# Altium schematic sheet ST_Link.SchDoc
size B
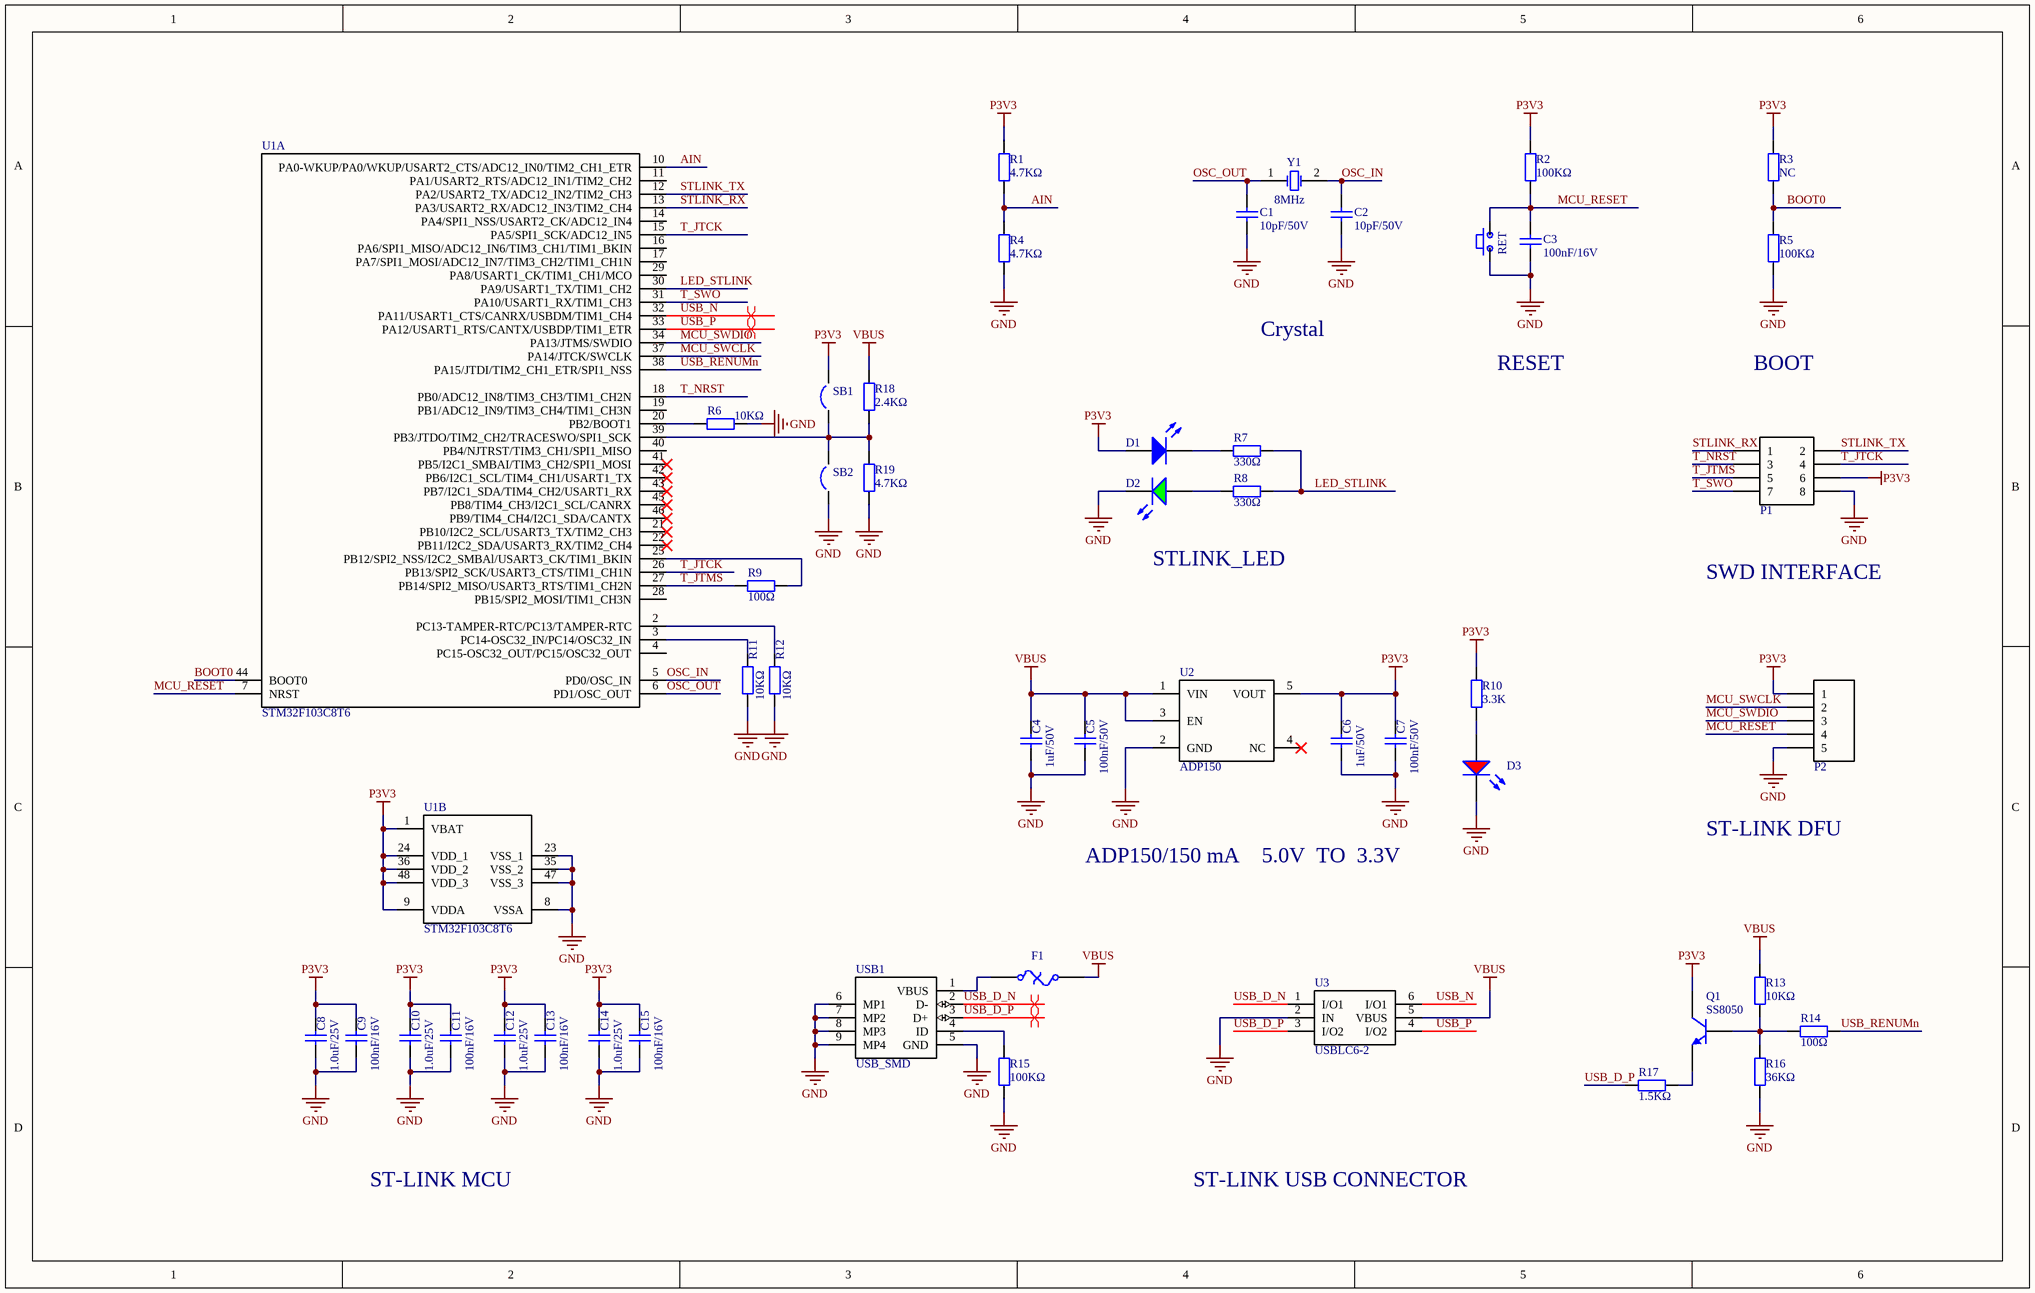
[diagram p0: ST_Link.SchDoc]

## Parts
C1  10pF/50V  [0402_C]
C2  10pF/50V  [0402_C]
C3  100nF/16V  [0402_C]
C4  1uF/50V  [0603_C]
C5  100nF/50V  [0603_C]
C6  1uF/50V  [0603_C]
C7  100nF/50V  [0603_C]
C8  1.0uF/25V  [0402_C]
C9  100nF/16V  [0402_C]
C10  1.0uF/25V  [0402_C]
C11  100nF/16V  [0402_C]
C12  1.0uF/25V  [0402_C]
C13  100nF/16V  [0402_C]
C14  1.0uF/25V  [0402_C]
C15  100nF/16V  [0402_C]
D1  (no value)  [0603_LED_S1]
D2  (no value)  [0603_LED_S1]
D3  红灯 0603  [0603_LED_S1]  (value not drawn)
F1  500mA  [F1206]  (value not drawn)
P1  Header  [SMT 2*4 2.54]  (value not drawn)
P2  Header 5  [DIP5_2.00]  (value not drawn)
Q1  SS8050  [SOT-23(SOT-23-3)]
R1  4.7KΩ  [0402_R]
R2  100KΩ  [0402_R]
R3  NC  [0402_R]
R4  4.7KΩ  [0402_R]
R5  100KΩ  [0402_R]
R6  10KΩ  [0402_R]
R7  330Ω  [0402_R]
R8  330Ω  [0402_R]
R9  100Ω  [0402_R]
R10  3.3K  [0603_R]
R11  10KΩ  [0402_R]
R12  10KΩ  [0402_R]
R13  10KΩ  [0402_R]
R14  100Ω  [0402_R]
R15  100KΩ  [0402_R]
R16  36KΩ  [0402_R]
R17  1.5KΩ  [0402_R]
R18  2.4KΩ  [0402_R]
R19  4.7KΩ  [0402_R]
RET  Button  [SKRKAHE020]  (value not drawn)
SB1  SB  [SB]  (value not drawn)
SB2  SB  [SB]  (value not drawn)
U1  STM32F103C8T6  [LQFP-48]  (parts A,B of 2)
U2  ADP150  [SOT23-5]
U3  USBLC6-2  [SOT23-6]
USB1  USB_SMD  [USB_Micro]
Y1  8MHz  [SMD-5032_2P]

## Nets
GND: C1.1 C2.1 C3.1 C4.1 C5.1 C6.1 C7.1 C8.1 C9.1 C10.1 C11.1 C12.1 C13.1 C14.1 C15.1 D2.K D3.K P1.8 P2.5 R4.1 R5.1 R6.1 R11.1 R12.1 R15.1 R16.1 R19.1 RET.1 SB2.2 U1.8(VSSA) U1.23(VSS_1) U1.35(VSS_2) U1.47(VSS_3) U2.2(GND) U3.2(IN) USB1.5(GND) USB1.6(MP1) USB1.7(MP2) USB1.8(MP3) USB1.9(MP4)
P3V3: C6.2 C7.2 C8.2 C9.2 C10.2 C11.2 C12.2 C13.2 C14.2 C15.2 D1.A P1.6 P2.1 Q1.3(C) R1.2 R2.2 R3.2 R10.2 SB1.2 U1.1(VBAT) U1.9(VDDA) U1.24(VDD_1) U1.36(VDD_2) U1.48(VDD_3) U2.5(VOUT)
VBUS: C4.2 C5.2 F1.2 R13.2 R18.2 U2.1(VIN) U2.3(EN) U3.5(VBUS)
AIN: R1.1 R4.2 U1.10(PA0-WKUP/PA0/WKUP/USART2_CTS/ADC12_IN0/TIM2_CH1_ETR)
BOOT0: R3.1 R5.2 U1.44(BOOT0)
LED_STLINK: R7.2 R8.2 U1.30(PA9/USART1_TX/TIM1_CH2)
MCU_RESET: C3.2 P2.4 R2.1 RET.2 U1.7(NRST)
MCU_SWCLK: P2.2 U1.37(PA14/JTCK/SWCLK)
MCU_SWDIO: P2.3 U1.34(PA13/JTMS/SWDIO)
OSC_IN: C2.2 U1.5(PD0/OSC_IN) Y1.2(OSC2)
OSC_OUT: C1.2 U1.6(PD1/OSC_OUT) Y1.1(OSC1)
STLINK_RX: P1.1 U1.13(PA3/USART2_RX/ADC12_IN3/TIM2_CH4)
STLINK_TX: P1.2 U1.12(PA2/USART2_TX/ADC12_IN2/TIM2_CH3)
T_JTCK: P1.4 U1.15(PA5/SPI1_SCK/ADC12_IN5) U1.26(PB13/SPI2_SCK/USART3_CTS/TIM1_CH1N)
T_JTMS: P1.5 R9.1 U1.27(PB14/SPI2_MISO/USART3_RTS/TIM1_CH2N)
T_NRST: P1.3 U1.18(PB0/ADC12_IN8/TIM3_CH3/TIM1_CH2N)
T_SWO: P1.7 U1.31(PA10/USART1_RX/TIM1_CH3)
USB_D_N: U3.1(I/O1) USB1.2(D-)
USB_D_P: R17.1 U3.3(I/O2) USB1.3(D+)
USB_N: U1.32(PA11/USART1_CTS/CANRX/USBDM/TIM1_CH4) U3.6(I/O1)
USB_P: U1.33(PA12/USART1_RTS/CANTX/USBDP/TIM1_ETR) U3.4(I/O2)
USB_RENUMn: R14.2 U1.38(PA15/JTDI/TIM2_CH1_ETR/SPI1_NSS)
NetD1_K: D1.K R7.1
NetD2_A: D2.A R8.1
NetD3_A: D3.A R10.1
NetF1_1: F1.1 USB1.1(VBUS)
NetQ1_1: Q1.1(B) R13.1 R14.1 R16.2
NetQ1_2: Q1.2(E) R17.2
NetR6_2: R6.2 U1.20(PB2/BOOT1)
NetR9_2: R9.2 U1.25(PB12/SPI2_NSS/I2C2_SMBAl/USART3_CK/TIM1_BKIN)
NetR11_2: R11.2 U1.3(PC14-OSC32_IN/PC14/OSC32_IN)
NetR12_2: R12.2 U1.2(PC13-TAMPER-RTC/PC13/TAMPER-RTC)
NetR15_2: R15.2 USB1.4(ID)
NetR18_1: R18.1 R19.2 SB1.1 SB2.1 U1.39(PB3/JTDO/TIM2_CH2/TRACESWO/SPI1_SCK)

Not connected (* = marked no-connect by the designer): U1 4(PC15-OSC32_OUT/PC15/OSC32_OUT) 11(PA1/USART2_RTS/ADC12_IN1/TIM2_CH2) 14(PA4/SPI1_NSS/USART2_CK/ADC12_IN4) 16(PA6/SPI1_MISO/ADC12_IN6/TIM3_CH1/TIM1_BKIN) 17(PA7/SPI1_MOSI/ADC12_IN7/TIM3_CH2/TIM1_CH1N) 19(PB1/ADC12_IN9/TIM3_CH4/TIM1_CH3N) 21(PB10/I2C2_SCL/USART3_TX/TIM2_CH3)* 22(PB11/I2C2_SDA/USART3_RX/TIM2_CH4)* 28(PB15/SPI2_MOSI/TIM1_CH3N) 29(PA8/USART1_CK/TIM1_CH1/MCO) 40(PB4/NJTRST/TIM3_CH1/SPI1_MISO) 41(PB5/I2C1_SMBAI/TIM3_CH2/SPI1_MOSI)* 42(PB6/I2C1_SCL/TIM4_CH1/USART1_TX)* 43(PB7/I2C1_SDA/TIM4_CH2/USART1_RX)* 45(PB8/TIM4_CH3/I2C1_SCL/CANRX)* 46(PB9/TIM4_CH4/I2C1_SDA/CANTX)*; U2 4(NC)*

## Layout directives
differential pair: USB_D_N, USB_D_P, USB_N, USB_P

## Notes on the sheet
- Crystal
- RESET
- BOOT
- STLINK_LED
- SWD INTERFACE
- ST-LINK DFU
- ADP150/150 mA    5.0V  TO  3.3V
- ST-LINK MCU
- ST-LINK USB CONNECTOR

## Library data of the parts
C1 C2 = 0402 10pF (100) 5% 50V: 贴片电容; ComponentLink1Description: 供应商链接; ComponentLink1URL: http://www.szlcsc.com/product/details_33914.html; Package: 0402; Supplier: LC; SuppliersPartNumber: C32949
C3 C9 C11 C13 C15 = 0402 100nF (104) 10% 16V: 贴片电容; ComponentLink1Description: 供应商链接; ComponentLink1URL: http://www.szlcsc.com/product/details_1877.html; Package: 0402; Supplier: LC; SuppliersPartNumber: C1525
C4 C6 = 0603 1uF (105) 10% 50V: 贴片电容; ComponentLink1Description: 供应商链接; ComponentLink1URL: http://www.szlcsc.com/product/details_16531.html; Package: 0603; Supplier: LC; SuppliersPartNumber: C15849
C5 C7 = 0603 100nF (104) 10% 50V: 贴片电容; ComponentLink1Description: 供应商链接; ComponentLink1URL: http://www.szlcsc.com/product/details_15331.html; Package: 0603; Supplier: LC; SuppliersPartNumber: C14663
C8 C10 C12 C14 = 0402 1.0uF (105) 10% 25V: 贴片电容; ComponentLink1Description: 供应商链接; ComponentLink1URL: http://www.szlcsc.com/product/details_53938.html; Package: 0402; Supplier: LC; SuppliersPartNumber: C52923
D1 = 0603 蓝灯: 发光二极管; ComponentLink1Description: 供应商链接; ComponentLink1URL: http://www.szlcsc.com/product/details_73150.html; Package: 0603; Supplier: LC; SuppliersPartNumber: C72041
D2 = 0603 绿灯: 发光二极管; ComponentLink1Description: 供应商链接; ComponentLink1URL: http://www.szlcsc.com/product/details_73152.html; Package: 0603; Supplier: LC; SuppliersPartNumber: C72043
D3 = 0603 红灯: 发光二极管; ComponentLink1Description: 供应商链接; ComponentLink1URL: http://www.szlcsc.com/product/details_2659.html; Package: 0603; Supplier: LC; SuppliersPartNumber: C2286
F1 = Fuse
P1 = Header 4X2: Header, 4-Pin, Dual row; LatestRevisionDate: 17-Jul-2002; LatestRevisionNote: Re-released for DXP Platform.; Publisher: Altium Limited
P2 = Header 5: Header, 5-Pin
Q1 = SOT-23 SS8050 Y1: 三极管; ComponentLink1Description: 供应商链接; ComponentLink1URL: http://www.szlcsc.com/product/details_2507.html; Package: SOT-23; Supplier: LC; SuppliersPartNumber: C2150
R1 R4 R19 = 0402 4.7KΩ (4701) 1%: 贴片电阻; ComponentLink1Description: 供应商链接; ComponentLink1URL: http://www.szlcsc.com/product/details_26643.html; Package: 0402; Supplier: LC; SuppliersPartNumber: C25900
R2 R5 R15 = 0402 100KΩ (1003) 1%: 贴片电阻; ComponentLink1Description: 供应商链接; ComponentLink1URL: http://www.szlcsc.com/product/details_26484.html; Package: 0402; Supplier: LC; SuppliersPartNumber: C25741
R3 R6 R11-R13 = 0402 10KΩ (1002) 1%: 贴片电阻; ComponentLink1Description: 供应商链接; ComponentLink1URL: http://www.szlcsc.com/product/details_26487.html; Package: 0402; Supplier: LC; SuppliersPartNumber: C25744
R7 R8 = 0402 330Ω (3300) 1%: 贴片电阻; ComponentLink1Description: 供应商链接; ComponentLink1URL: http://www.szlcsc.com/product/details_25847.html; Package: 0402; Supplier: LC; SuppliersPartNumber: C25104
R9 R14 = 0402 100Ω (1000) 1%: 贴片电阻; ComponentLink1Description: 供应商链接; ComponentLink1URL: http://www.szlcsc.com/product/details_25819.html; Package: 0402; Supplier: LC; SuppliersPartNumber: C25076
R10 = 0603 3.3KΩ (3301) 1%: 贴片电阻; ComponentLink1Description: 供应商链接; ComponentLink1URL: http://www.szlcsc.com/product/details_23705.html; Package: 0603; Supplier: LC; SuppliersPartNumber: C22978
R16 = 0402 39KΩ (3902) 1%: 贴片电阻; ComponentLink1Description: 供应商链接; ComponentLink1URL: http://www.szlcsc.com/product/details_26526.html; Package: 0402; Supplier: LC; SuppliersPartNumber: C25783
R17 = 0402 1.5KΩ (1501) 1%: 贴片电阻; ComponentLink1Description: 供应商链接; ComponentLink1URL: http://www.szlcsc.com/product/details_26610.html; Package: 0402; Supplier: LC; SuppliersPartNumber: C25867
R18 = 0402 2.4KΩ (2401) 1%: 贴片电阻; ComponentLink1Description: 供应商链接; ComponentLink1URL: http://www.szlcsc.com/product/details_26625.html; Package: 0402; Supplier: LC; SuppliersPartNumber: C25882
U1 = STM32F103C8T6: Mainstream Performance line, ARM Cortex-M3 MCU with 64 Kbytes Flash, 72 MHz CPU, motor control, USB and CAN
U2 = ADP150: Ultralow Noise,150 mA CMOS Linear Regulator
U3 = USBLC6-2: Very low capacitance ESD protection
Y1 = SMD-5032_2P 8MHz 20ppm 20pF: 贴片晶振; ComponentLink1Description: 供应商链接; ComponentLink1URL: http://www.szlcsc.com/product/details_117214.html; Package: SMD-5032_2P; Supplier: LC; SuppliersPartNumber: C115962